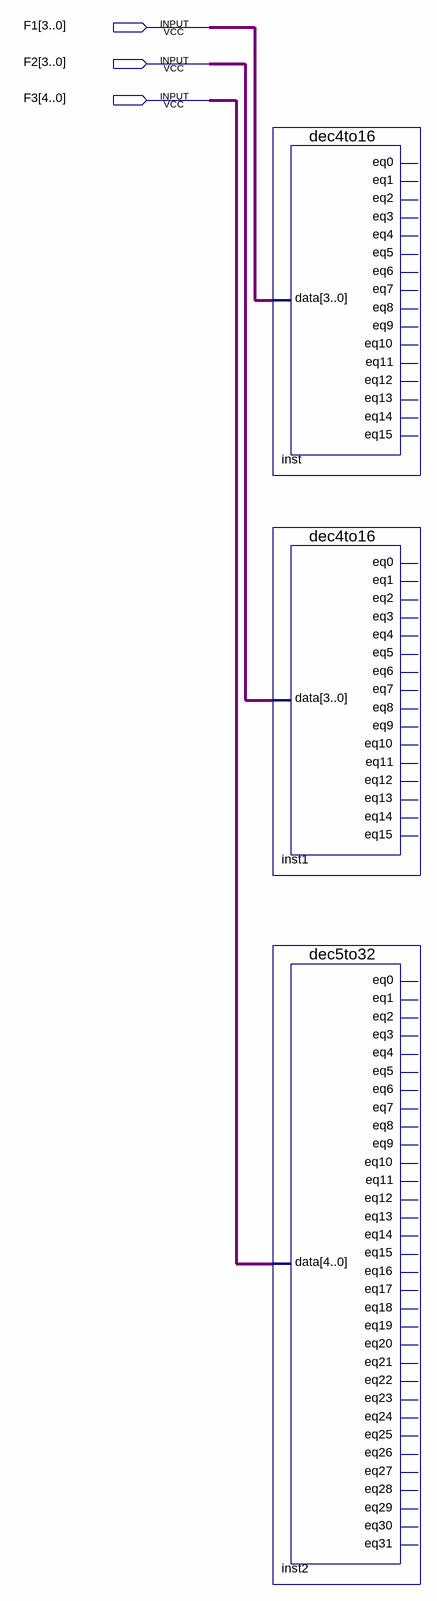
[diagram p0: schematic sheet]
// Quartus schematic CPUt4.bdf as structural Verilog: 3 symbols, 3 pins
module CPUt4 (
  input  [3:0] F1,
  input  [3:0] F2,
  input  [4:0] F3
);

  dec4to16 inst (.data(F1));  // open: eq0, eq1, eq2, eq3, eq4, eq5, eq6, eq7, eq8, eq9, eq10, eq11, eq12, eq13, eq14, eq15
  dec4to16 inst1 (.data(F2));  // open: eq0, eq1, eq2, eq3, eq4, eq5, eq6, eq7, eq8, eq9, eq10, eq11, eq12, eq13, eq14, eq15
  dec5to32 inst2 (.data(F3));  // open: eq0, eq1, eq2, eq3, eq4, eq5, eq6, eq7, eq8, eq9, eq10, eq11, eq12, eq13, eq14, eq15, eq16, eq17, eq18, eq19, eq20, eq21, eq22, eq23, eq24, eq25, eq26, eq27, eq28, eq29, eq30, eq31
endmodule
